# EAGLE design RDA5807M (EAGLE 9.5.1)
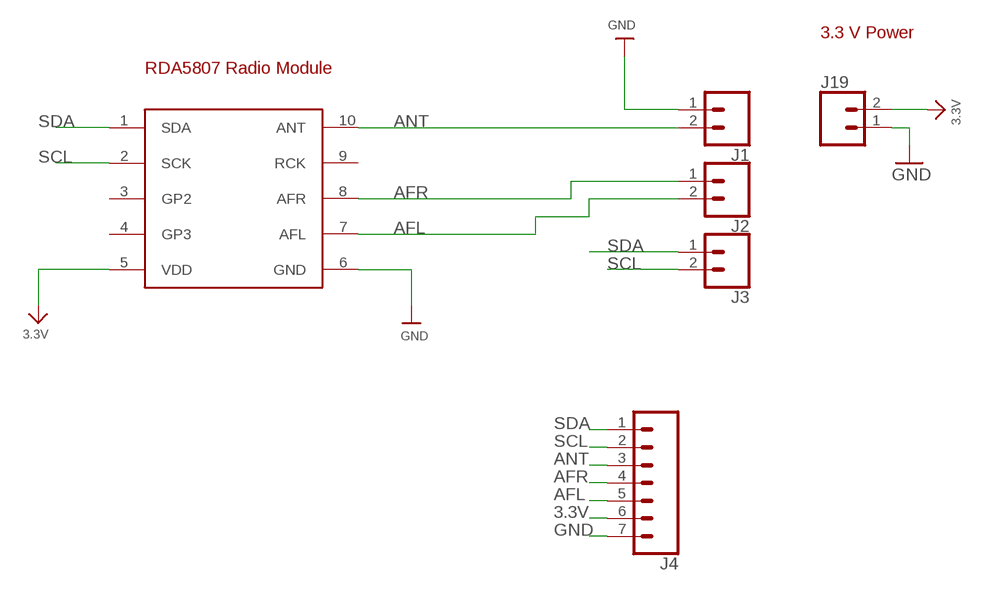
[diagram p0: schematic, sheet 1]

## Parts
J1  CONN_025MM  [SCREWTERMINAL-5MM-2]
J2  CONN_025MM  [SCREWTERMINAL-5MM-2]
J3  CONN_025MM  [SCREWTERMINAL-5MM-2]
J4  CONN_07  [1X07]
J19  CONN_025MM  [SCREWTERMINAL-5MM-2]
U$17  RDA5807_RADIO  [RDA5807]

## Nets
3.3V [power]: J4.6 J19.2 U$17.5(VDD)
AFL: J2.2 J4.5 U$17.7(AFL)
AFR: J2.1 J4.4 U$17.8(AFR)
ANT: J1.2 J4.3 U$17.10(ANT)
GND: J1.1 J4.7 J19.1 U$17.6(GND)
SCL: J3.2 J4.2 U$17.2(SCK)
SDA: J3.1 J4.1 U$17.1(SDA)
Unconnected: U$17.3(GP2) U$17.4(GP3) U$17.9(RCK)

## Notes on the sheet
- 3.3 V Power
- RDA5807 Radio Module

## Library data of the parts
J1-J3 J19 = SparkFun-Connectors:CONN_02: Multi connection point. Often used as Generic Header-pin footprint for 0.1 inch spaced/style header connections On any of the 0.1 inch spaced packages, you can populate with these: Break Away Headers - Straight <https://www.sparkfun.com/products/116> (PRT-00116) Break Away Male Headers - Right Angle <https://www.sparkfun.com/products/553> (PRT-00553) Female Headers <https://www.sparkfun.com/products/115> (PRT-00115) Break Away Headers - Machine Pin <https://www.sparkfun.com/products/117> (PRT-00117) Break Away Female Headers - Swiss Machine Pin <https://www.sparkfun.com/products/743> (PRT-00743) For SCREWTERMINALS and SPRING TERMINALS visit here: Screw Terimnals on SparkFun.com <https://www.sparkfun.com/search/results?term=Screw+Terminals> (5mm/3.5mm/2.54mm spacing) This device is also useful as a general connection point to wire up your design to another part of your project. Our various solder wires solder well into these plated through hole pads. Hook-Up Wire - Assortment (Stranded, 22 AWG) <https://www.sparkfun.com/products/11375> (PRT-11375) Hook-Up Wire - Assortment (Solid Core, 22 AWG) <https://www.sparkfun.com/products/11367> (PRT-11367) View the entire wire category on our website here <https://www.sparkfun.com/categories/141> Special notes: Molex polarized connector foot print use with: PRT-08233 with associated crimp pins and housings. 2.54_SCREWTERM for use with PRT-10571. 3.5mm Screw Terminal footprints for PRT-08084 5mm Screw Terminal footprints for use with PRT-08432; SF_SKU: PRT-08432
J4 = SparkFun-Connectors:CONN_07: Multi connection point. Often used as Generic Header-pin footprint for 0.1 inch spaced/style header connections On any of the 0.1 inch spaced packages, you can populate with these: Break Away Headers - Straight <https://www.sparkfun.com/products/116> (PRT-00116) Break Away Male Headers - Right Angle <https://www.sparkfun.com/products/553> (PRT-00553) Female Headers <https://www.sparkfun.com/products/115> (PRT-00115) Break Away Headers - Machine Pin <https://www.sparkfun.com/products/117> (PRT-00117) Break Away Female Headers - Swiss Machine Pin <https://www.sparkfun.com/products/743> (PRT-00743) For SCREWTERMINALS and SPRING TERMINALS visit here: Screw Terimnals on SparkFun.com <https://www.sparkfun.com/search/results?term=Screw+Terminals> (5mm/3.5mm/2.54mm spacing) This device is also useful as a general connection point to wire up your design to another part of your project. Our various solder wires solder well into these plated through hole pads. Hook-Up Wire - Assortment (Stranded, 22 AWG) <https://www.sparkfun.com/products/11375> (PRT-11375) Hook-Up Wire - Assortment (Solid Core, 22 AWG) <https://www.sparkfun.com/products/11367> (PRT-11367) View the entire wire category on our website here <https://www.sparkfun.com/categories/141> Special notes: Molex polarized connector foot print use with SKU : PRT-08231 with associated crimp pins and housings. 1MM SMD Version SKU: PRT-10208 NOTES ON THE VARIANTS LOCK and LOCK_LONGPADS... This footprint was designed to help hold the alignment of a through-hole component (i.e. 6-pin header) while soldering it into place. You may notice that each hole has been shifted either up or down by 0.005 of an inch from it's more standard position (which is a perfectly straight line). This slight alteration caused the pins (the squares in the middle) to touch the edges of the holes. Because they are alternating, it causes a "brace" to hold the component in place. 0.005 has proven to be the perfect amount of "off-center" position when using our standard breakaway headers. Although looks a little odd when you look at the bare footprint, once you have a header in there, the alteration is very hard to notice. Also,if you push a header all the way into place, it is covered up entirely on the bottom side.
U$17 = th_libraries_2:RDA5807_RADIO: Radio Module off aliexpress StereoFM-Radio-Module-RDA5807M

## Net classes
1 power: width 0.254 mm

## Board
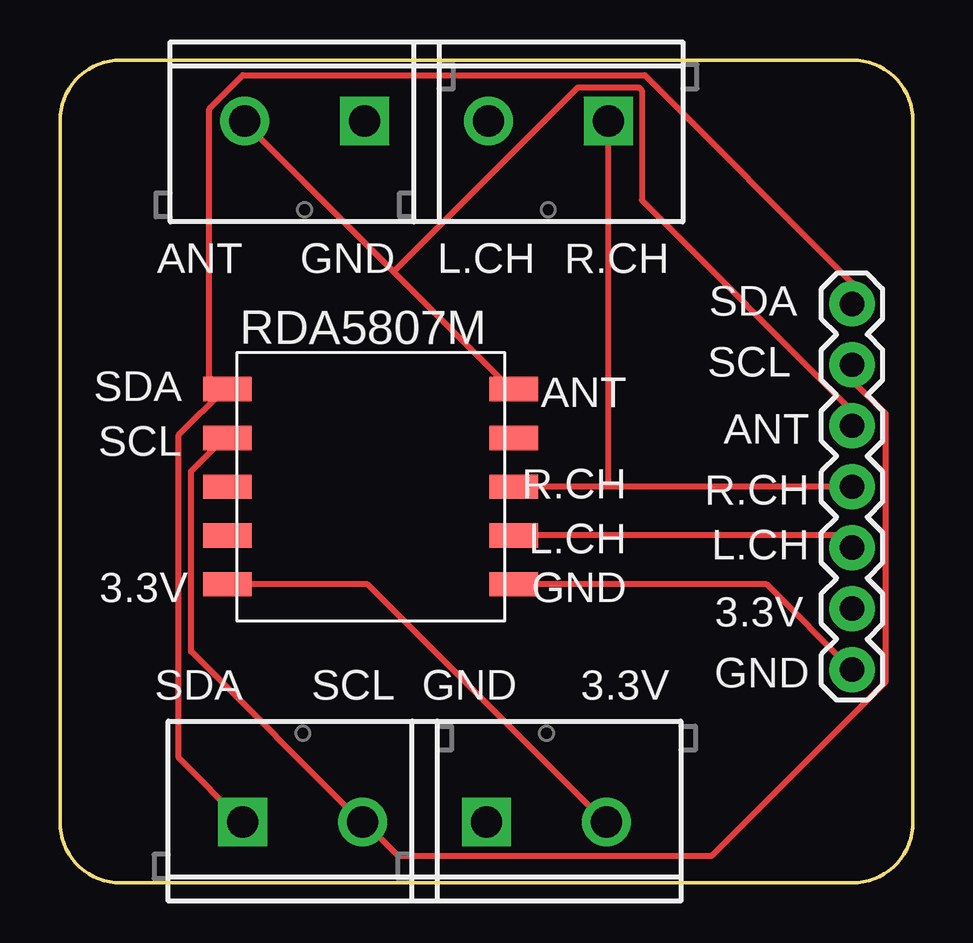
[diagram p1: board, top side]
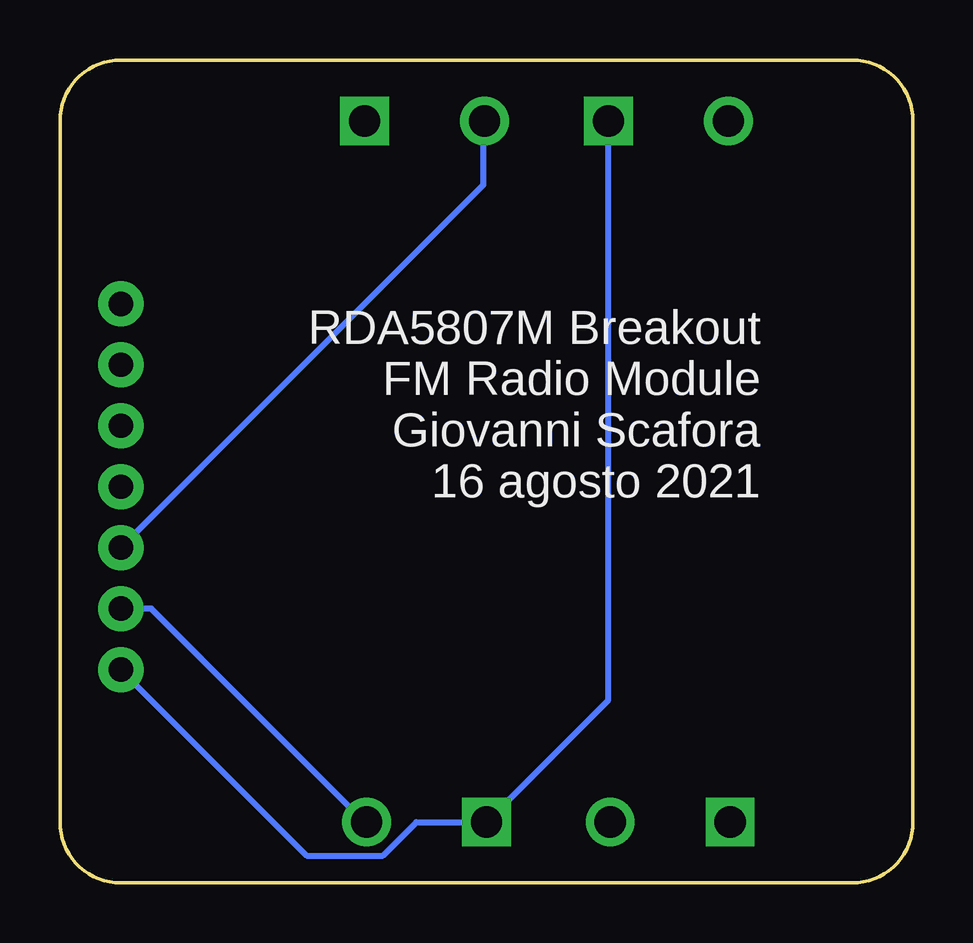
[diagram p2: board, bottom side, seen from below]

Size 35.56 x 34.29 mm. Coordinates in mm from the lower left corner, seen from the top.
Outline: 33.02,0 2.54,0 arc-90 0,2.54 0,31.75 arc-90 2.54,34.29 33.02,34.29 arc-90 35.56,31.75 35.56,2.54 arc-90 33.02,0
Copper layers (1*16): Top 0.0356mm / dielectric 1.5011mm / Bottom 0.0356mm
Design rules "LaenPCBOrder *": minimum track width 10mil, minimum drill 13mil, track to track 10mil, track to pad 10mil, pad to pad 10mil, via to via 10mil, smd to smd 0mil, copper to edge 15mil, drill to drill 6mil, minimum pad ring 7mil, minimum via ring 7mil, stop-mask expansion 3mil, vias tented up to drill 0mil, thermal gap 10mil

### Footprints (pad centres in the part's own frame; a part is rotated, then mirrored left to right if it is on the bottom)
SCREWTERMINAL-5MM-2 = drill 1.3 pad 2.032 square: 1 0,0 | drill 1.3 pad 2.032: 2 5,0
1X07 = drill 1.016 pad 1.88: 1 0,0; 2 2.54,0; 3 5.08,0; 4 7.62,0; 5 10.16,0; 6 12.7,0; 7 15.24,0
RDA5807 = smd 2.032 x 1.016: 1 -0.384,9.652; 2 -0.384,7.62; 3 -0.384,5.588; 4 -0.384,3.556; 5 -0.384,1.524; 6 11.554,1.524; 7 11.554,3.556; 8 11.554,5.588; 9 11.554,7.62; 10 11.554,9.652

### Placement (x,y rotation side)
J1  12.7,31.75 180 top
J2  22.86,31.75 180 top
J3  7.62,2.54 0 top
J4  33.02,24.13 270 top
J19  17.78,2.54 0 top
U$17  7.37,10.92 0 top

### Tracks (layer width: path | path; a pad name or v marks a point on that pad's centre or on a via)
3.3V
  Top 0.254: U$17.5 12.83,12.45 22.73,2.54 J19.2
  Bottom 0.254: J4.6 31.75,11.43 22.86,2.54 J19.2
AFL
  Top 0.254: U$17.7 32.51,14.48 J4.5
  Bottom 0.254: J4.5 17.91,29.08 17.91,31.75 J2.2
AFR
  Top 0.254: J4.4 22.86,16.51 | 22.86,16.51 U$17.8 | 22.86,16.51 J2.1
ANT
  Top 0.254: 13.91,25.46 7.62,31.75 J1.2 | 13.91,25.46 18.8,20.57 U$17.10 | J4.3 33.02,19.68 24.26,28.45 24.26,33.02 24.13,33.15 21.59,33.15 13.91,25.46
GND
  Top 0.254: U$17.6 29.46,12.45 J4.7
  Bottom 0.254: J4.7 25.27,1.14 22.1,1.14 20.7,2.54 J19.1 12.7,7.62 J1.1
SCL
  Top 0.254: U$17.2 6.86,18.54 5.46,17.14 5.46,9.65 12.57,2.54 J3.2 12.7,2.54 14.1,1.14 27.18,1.14 34.42,8.38 34.42,19.56 33.02,20.95 J4.2
SDA
  Top 0.254: J3.1 4.95,5.21 4.95,18.67 6.86,20.57 U$17.1 6.73,20.57 6.22,21.08 6.22,32.26 7.62,33.66 24.38,33.66 33.02,25.02 J4.1

### Text on the board
tPlace: ANT | GND | L.CH | R.CH | SDA | RDA5807M | SCL | SDA | ANT | ANT | SCL | R.CH | R.CH | L.CH | L.CH | 3.3V | GND | 3.3V | SDA | SCL | GND | 3.3V | GND
bPlace: RDA5807M Breakout / FM Radio Module / Giovanni Scafora / 16 agosto 2021